# EAGLE design TN Deck _Display Board (EAGLE 9.7.0)
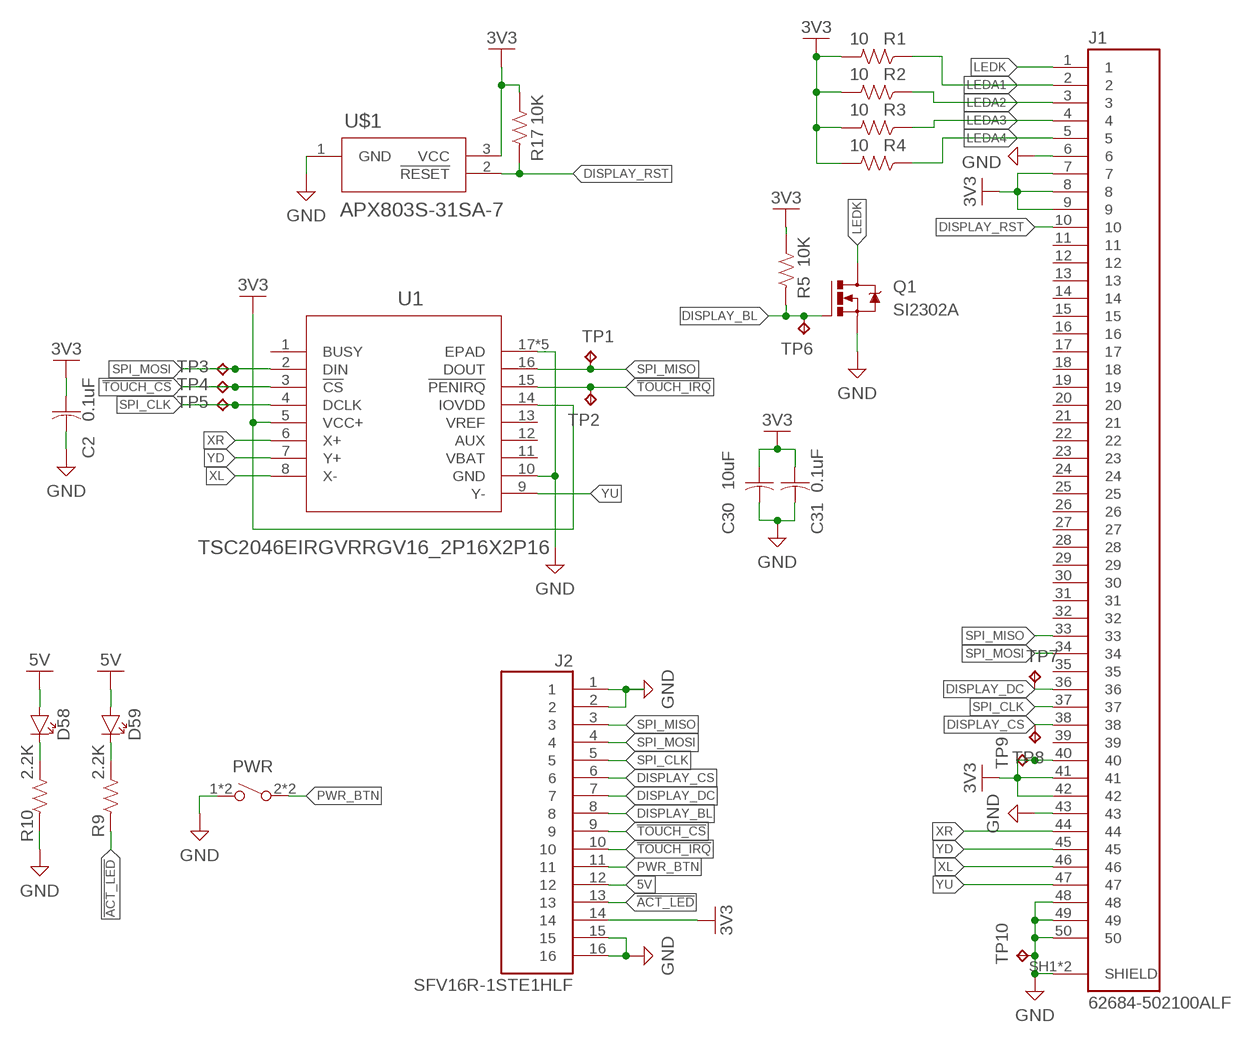
[diagram p0: schematic, sheet 1]

## Parts
C2  0.1uF  C-US_CHIP-0603(1608-METRIC)  [CAPC1608X85]
C30  10uF  C-US_CHIP-0805(2012-METRIC)  [CAPC2012X110]
C31  0.1uF  C-US_CHIP-0603(1608-METRIC)  [CAPC1608X85]
D58  CHIP-FLAT-G_0603-0.80MM  [LEDC1608X80N_FLAT-G]
D59  CHIP-FLAT-G_0603-0.80MM  [LEDC1608X80N_FLAT-G]
J1  62684-502100ALF  [AMPHENOL_62684-502100ALF]
J2  SFV16R-1STE1HLF  [AMPHENOL_SFV16R-1STE1HLF]
PWR  SPST-NO_SWITCH_KMR2  [KMR2]
Q1  SI2302A  NMOSFET_SOT23-GSD  [SOT23]
R1  10  R-US_CHIP-0603(1608-METRIC)  [RESC1608X60]
R2  10  R-US_CHIP-0603(1608-METRIC)  [RESC1608X60]
R3  10  R-US_CHIP-0603(1608-METRIC)  [RESC1608X60]
R4  10  R-US_CHIP-0603(1608-METRIC)  [RESC1608X60]
R5  10K  R-US_CHIP-0603(1608-METRIC)  [RESC1608X60]
R9  2.2K  R-US_CHIP-0603(1608-METRIC)  [RESC1608X60]
R10  2.2K  R-US_CHIP-0603(1608-METRIC)  [RESC1608X60]
R17  10K  R-US_CHIP-0603(1608-METRIC)  [RESC1608X60]
TP1  TPB1,27  [B1,27]
TP2  TPB1,27  [B1,27]
TP3  TPB1,27  [B1,27]
TP4  TPB1,27  [B1,27]
TP5  TPB1,27  [B1,27]
TP6  TPB1,27  [B1,27]
TP7  TPB1,27  [B1,27]
TP8  TPB1,27  [B1,27]
TP9  TPB1,27  [B1,27]
TP10  TPB1,27  [B1,27]
U1  TSC2046EIRGVRRGV16_2P16X2P16  [RGV16_2P16X2P16]
U$1  APX803S-31SA-7  [SOT-23_DIO]

## Nets
3V3: C2.1 C30.1 C31.1 J1.7 J1.8 J1.9 J1.40 J1.41 J1.42 J2.14 R1.2 R2.2 R3.2 R4.2 R5.2 R17.2 TP9.TP U1.5(VCC+) U1.14(IOVDD) U$1.3(VCC)
5V: D58.A D59.A J2.12
!ACT_LED: J2.13 R9.1
!TOUCH_CS: J2.9 TP4.TP U1.3(!CS)
!TOUCH_IRQ: J2.10 TP2.TP U1.15(!PENIRQ)
DISPLAY_BL: J2.8 Q1.1(G) R5.1 TP6.TP
DISPLAY_CS: J1.38 J2.6 TP8.TP
DISPLAY_DC: J1.36 J2.7 TP7.TP
DISPLAY_RST: J1.10 R17.1 U$1.2(!RESET)
GND: C2.2 C30.2 C31.2 J1.6 J1.43 J1.48 J1.49 J1.50 J1.SH1(SHIELD) J1.SH2(SHIELD) J2.1 J2.2 J2.15 J2.16 PWR.1 PWR.4 Q1.2(S) R10.1 TP10.TP U1.10(GND) U1.17(EPAD) U1.V(EPAD) U1.V_1(EPAD) U1.V_2(EPAD) U1.V_3(EPAD) U$1.1(GND)
LEDA1: J1.2 R1.1
LEDA2: J1.3 R2.1
LEDA3: J1.4 R3.1
LEDA4: J1.5 R4.1
LEDK: J1.1 Q1.3(D)
N$3: D59.C R9.2
N$71: D58.C R10.2
PWR_BTN: J2.11 PWR.2 PWR.3
SPI_CLK: J1.37 J2.5 TP5.TP U1.4(DCLK)
SPI_MISO: J1.33 J2.3 TP1.TP U1.16(DOUT)
SPI_MOSI: J1.34 J2.4 TP3.TP U1.2(DIN)
XL: J1.46 U1.8(X-)
XR: J1.44 U1.6(X+)
YD: J1.45 U1.7(Y+)
YU: J1.47 U1.9(Y-)
Unconnected: J1.11 J1.12 J1.13 J1.14 J1.15 J1.16 J1.17 J1.18 J1.19 J1.20 J1.21 J1.22 J1.23 J1.24 J1.25 J1.26 J1.27 J1.28 J1.29 J1.30 J1.31 J1.32 J1.35 J1.39 U1.1(BUSY) U1.11(VBAT) U1.12(AUX)

## Power pins joined to a net without a drawn wire
VREF: U1.13(VREF)

## Library data of the parts
C2 C31 = Capacitor:C-US: Capacitor - ANSI; CATEGORY: Capacitor; PACKAGE_SIZE: 0603; PACKAGE_TYPE: Surface Mount; SUBCATEGORY: Ceramic Capacitors; TYPE: MLCC; VENDOR: Digikey; VPN: 399-C0603C104K3RACTUCT-ND
C30 = Capacitor:C-US: Capacitor - ANSI; CATEGORY: Capacitor; PACKAGE_SIZE: 0805; PACKAGE_TYPE: Surface Mount; SUBCATEGORY: Ceramic Capacitors; TYPE: MLCC; VENDOR: Digikey; VPN: 1292-0805X106K250CT-ND
D58 D59 = LED:CHIP-FLAT-G: Green LED - Generic; CATEGORY: LED; COLOR: Green; DESCRIPTION: Green LED Indication 0603 (1608 Metric); PACKAGE_SIZE: 0603; PACKAGE_TYPE: Surface Mount; SUBCATEGORY: Chip LED; TYPE: Square with Flat Top; VENDOR: Digikey; VPN: 732-4980-1-ND
J1 = 2.8 TFT Display:62684-502100ALF; MANUFACTURER: Amphenol; MAXIMUM_PACKAGE_HEIGHT: 2.00mm; PARTREV: AM; SNAPEDA_PN: 62684-502100ALF; STANDARD: Manufacturer Recommendations; VENDOR: Digikey; VPN: 609-1202-1-ND
J2 = SFV16R-1STE1HLF:SFV16R-1STE1HLF; MANUFACTURER: Amphenol; MAXIMUM_PACKAGE_HEIGHT: 2.36mm; PARTREV: B; STANDARD: Manufacturer Recommendations; VENDOR: Digikey; VPN: 609-4313-1-ND
PWR = Switch:SPST-NO_SWITCH: SPST Switches with NO Configuration; CATEGORY: Switches; DATASHEET: https://www.ckswitches.com/media/1479/kmr2.pdf; DESCRIPTION: Tactile Switch SPST-NO Top Actuated Surface Mount; MANUFACTURER: C&K; MPN: KMR211G LFS; OPERATING_TEMPERATURE: -40°C ~ 85°C; PACKAGE_SIZE: NA; PACKAGE_TYPE: Surface Mount; PART_STATUS: Active; ROHS: Compliant; SERIES: KMR2; SUBCATEGORY: Tactile Switches; TYPE: SPST-NO; VENDOR: Digikey; VPN: 401-1426-1-ND
Q1 = Transistor:NMOSFET: N-Channel MOSFET - Generic; CATEGORY: Transistor; DATASHEET: https://www.analog.com/media/en/package-pcb-resources/package/pkg_pdf/ltc-legacy-sot-23/sot3%2005-08-1631%20rev%20d.pdf; DESCRIPTION: Generic N Channel MOSFET SOT23-GSD Package Surface Mount; PACKAGE_SIZE: SOT23; PACKAGE_TYPE: Surface Mount; SUBCATEGORY: MOSFET; TYPE: N-Channel; VENDOR: Digikey; VPN: 4518-SI2302ACT-ND
R1-R4 = Resistor:R-US: Resistor Fixed - ANSI; CATEGORY: Resistors; DESCRIPTION: Chip Resistor 1.60 X 0.82 X 0.60 mm body 0603(1608-METRIC) Package; PACKAGE_SIZE: 0603; PACKAGE_TYPE: Surface Mount; VENDOR: Digikey; VPN: 541-10.0HCT-ND
R5 R17 = Resistor:R-US: Resistor Fixed - ANSI; CATEGORY: Resistors; DESCRIPTION: Chip Resistor 1.60 X 0.82 X 0.60 mm body 0603(1608-METRIC) Package; PACKAGE_SIZE: 0603; PACKAGE_TYPE: Surface Mount; VENDOR: Digikey; VPN: 541-10.0KHCT-ND
R9 R10 = Resistor:R-US: Resistor Fixed - ANSI; CATEGORY: Resistors; DESCRIPTION: Chip Resistor 1.60 X 0.82 X 0.60 mm body 0603(1608-METRIC) Package; PACKAGE_SIZE: 0603; PACKAGE_TYPE: Surface Mount; VENDOR: Digikey; VPN: 541-2.20KHCT-ND
TP1-TP10 = testpad:TP: Test pad
U1 = TSC2046EIRGVR:TSC2046EIRGVR; COPYRIGHT: Copyright (C) 2026 Ultra Librarian. All rights reserved.; DATASHEET: https://www.ti.com/lit/gpn/tsc2046e; DESCRIPTION: 4-Wire Touch Screen Controller with low voltage digital I/O and extended ESD protection 16-VQFN -40 to 85; MANUFACTURER_NAME: Texas Instruments; MANUFACTURER_PART_NUMBER: TSC2046EIRGVR; VENDOR: Digikey; VPN: 296-46257-1-ND
U$1 = APX803S-31SA-7:APX803S-31SA-7; VENDOR: Digikey; VPN: APX803S-31SA-7DICT-ND

## Board
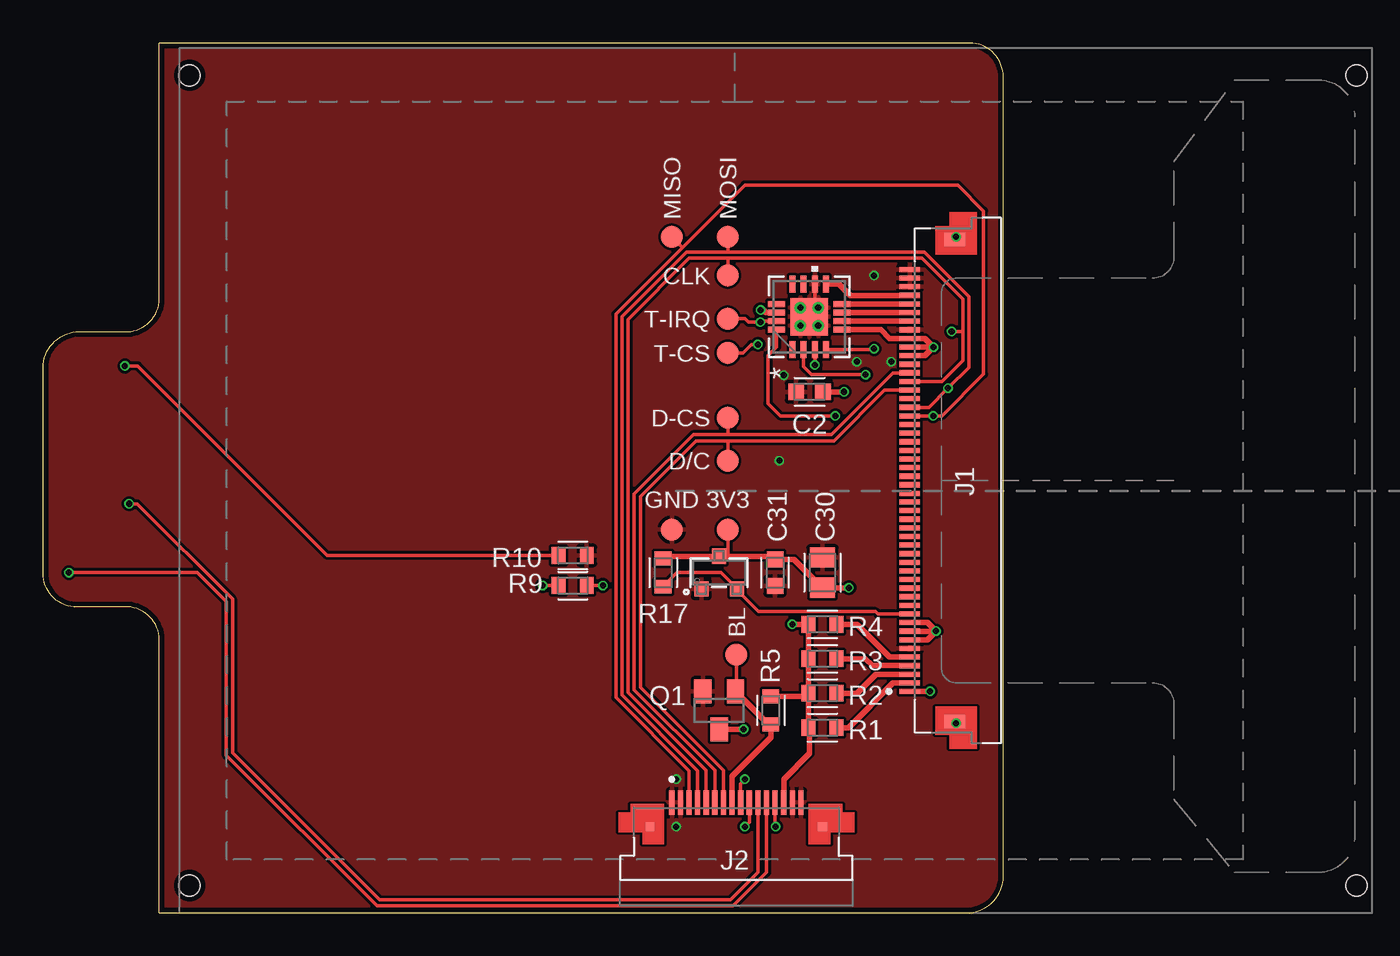
[diagram p1: board, top side]
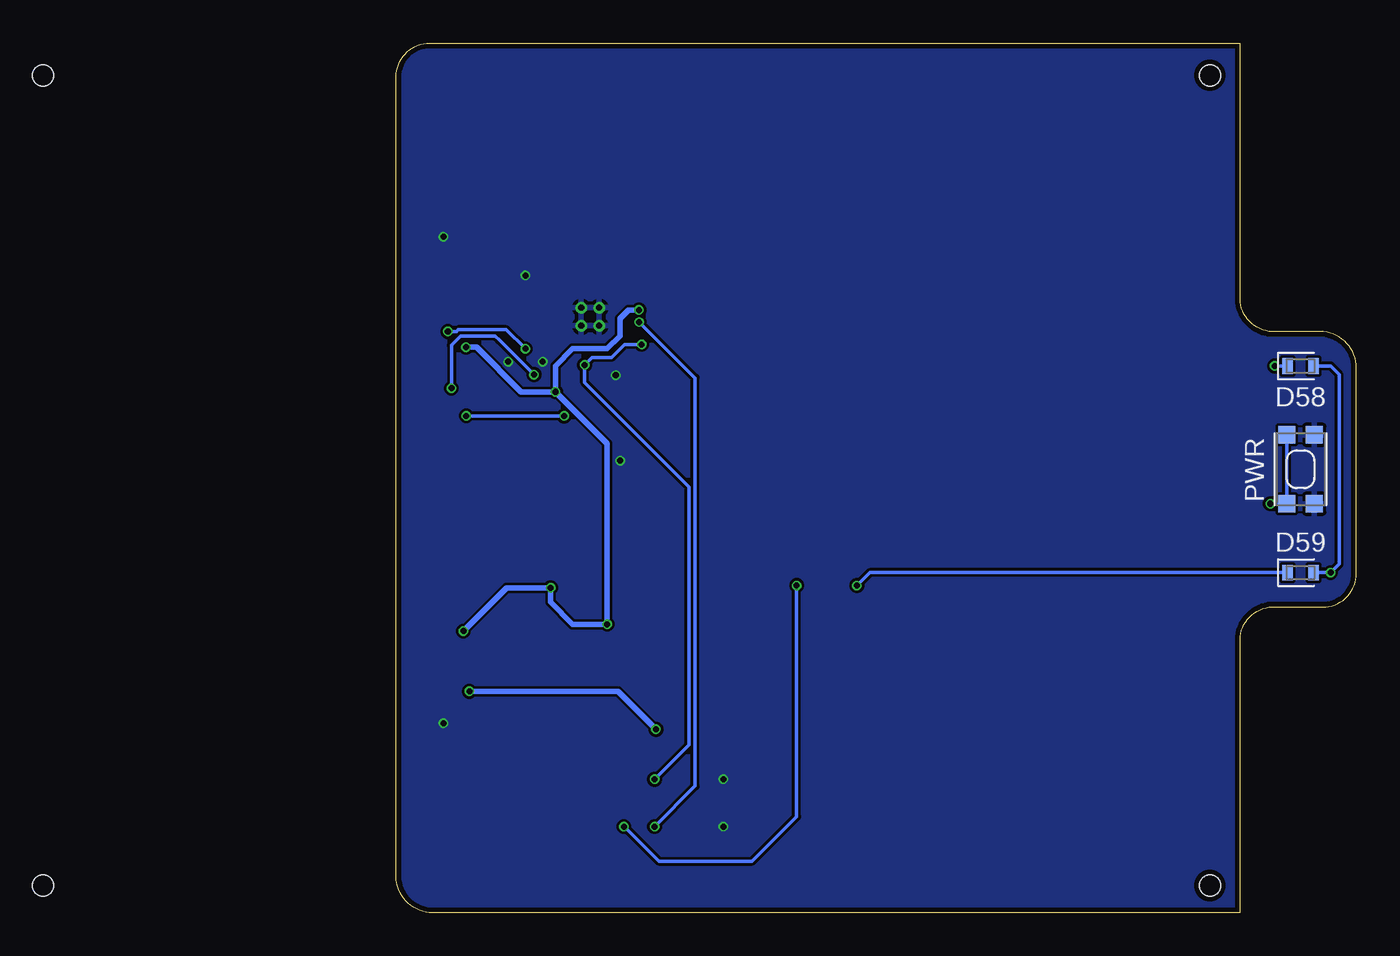
[diagram p2: board, bottom side, seen from below]

Size 55.75 x 50.5 mm. Coordinates in mm from the lower left corner, seen from the top.
Outline: 6.75,0 53.63,0 arc90 55.75,2.12 55.75,48.54 arc90 53.79,50.5 6.75,50.5 6.75,35.46 arc-90 4.54,33.75 2.12,33.75 arc90 0,31.63 0,19.71 arc90 1.96,17.75 4.54,17.75 arc-90 6.75,16.04 6.75,0
Copper layers (1*16): Top 0.035mm / dielectric 1.5mm / Bottom 0.035mm
Design rules "PCBWay_2L_152um-Track.dru *": minimum track width 6mil, minimum drill 0.3mm, track to track 6mil, track to pad 6mil, pad to pad 6mil, via to via 6mil, smd to smd 0mil, copper to edge 0.3mm, drill to drill 10mil, minimum pad ring 6mil, minimum via ring 0.1mm, stop-mask expansion 2mil, vias tented up to drill 0.45mm, thermal gap 0.2mm

### Footprints (pad centres in the part's own frame; a part is rotated, then mirrored left to right if it is on the bottom)
CAPC1608X85 = smd 0.921 x 0.97: 1 -0.775,0; 2 0.775,0
CAPC2012X110 = smd 1.165 x 1.465: 1 -0.875,0; 2 0.875,0
LEDC1608X80N_FLAT-G = smd 0.612 x 0.912: A 0.75,0; C -0.75,0
AMPHENOL_62684-502100ALF = smd 0.3 x 1.2: 1 -12.25,5.34; 2 -11.75,5.34; 3 -11.25,5.34; 4 -10.75,5.34; 5 -10.25,5.34; 6 -9.75,5.34; 7 -9.25,5.34; 8 -8.75,5.34; 9 -8.25,5.34; 10 -7.75,5.34; 11 -7.25,5.34; 12 -6.75,5.34; 13 -6.25,5.34; 14 -5.75,5.34; 15 -5.25,5.34; 16 -4.75,5.34; 17 -4.25,5.34; 18 -3.75,5.34; 19 -3.25,5.34; 20 -2.75,5.34; 21 -2.25,5.34; 22 -1.75,5.34; 23 -1.25,5.34; 24 -0.75,5.34; 25 -0.25,5.34; 26 0.25,5.34; 27 0.75,5.34; 28 1.25,5.34; 29 1.75,5.34; 30 2.25,5.34; 31 2.75,5.34; 32 3.25,5.34; 33 3.75,5.34; 34 4.25,5.34; 35 4.75,5.34; 36 5.25,5.34; 37 5.75,5.34; 38 6.25,5.34; 39 6.75,5.34; 40 7.25,5.34; 41 7.75,5.34; 42 8.25,5.34; 43 8.75,5.34; 44 9.25,5.34; 45 9.75,5.34; 46 10.25,5.34; 47 10.75,5.34; 48 11.25,5.34; 49 11.75,5.34; 50 12.25,5.34 | smd 0.8 x 1.2: SH1 -14,2.74; SH2 14,2.74 | hole 1.2: 23.52,47.16; -23.52,47.16; 23.52,-20.59; -23.52,-20.59
AMPHENOL_SFV16R-1STE1HLF = smd 0.3 x 1.4: 1 -3.75,2.4; 2 -3.25,2.4; 3 -2.75,2.4; 4 -2.25,2.4; 5 -1.75,2.4; 6 -1.25,2.4; 7 -0.75,2.4; 8 -0.25,2.4; 9 0.25,2.4; 10 0.75,2.4; 11 1.25,2.4; 12 1.75,2.4; 13 2.25,2.4; 14 2.75,2.4; 15 3.25,2.4; 16 3.75,2.4 | smd 0.5 x 0.5: SH1 -5,1; SH2 5,1
KMR2 = smd 1 x 1: 1 2,0.8; 2 2,-0.8; 3 -2,-0.8; 4 -2,0.8
SOT23 = smd 1 x 1.4: 1 -0.95,-1.1; 2 0.95,-1.1; 3 0,1.1
RESC1608X60 = smd 0.799 x 0.974: 1 -0.815,0; 2 0.815,0
B1,27 = smd 1.27 x 1.27: TP 0,0
RGV16_2P16X2P16 = smd 1 x 0.35: 1 -1.9,0.975; 2 -1.9,0.325; 3 -1.9,-0.325; 4 -1.9,-0.975; 9 1.9,-0.975; 10 1.9,-0.325; 11 1.9,0.325; 12 1.9,0.975 | smd 0.35 x 1: 5 -0.75,-1.9; 6 -0.25,-1.9; 7 0.25,-1.9; 8 0.75,-1.9; 13 0.75,1.9; 14 0.25,1.9; 15 -0.25,1.9; 16 -0.75,1.9 | smd 2.16 x 2.16: 17 0,0 | drill 0.35: V -0.521,-0.521; V_1 -0.521,0.521; V_2 0.521,-0.521; V_3 0.521,0.521
SOT-23_DIO = smd 0.813 x 0.889: 1 -1.025,-0.945; 2 1.025,-0.945; 3 0,0.945

### Placement (x,y rotation side)
C2  44.5,30.25 180 top
C30  45.25,19.75 90 top
C31  42.5,19.75 270 top
D58  3.25,31.75 0 bottom
D59  3.25,19.75 0 bottom
J1  55.66,25.1 90 top
J2  40.25,4 0 top
PWR  3.25,25.75 270 bottom
Q1  39.25,11.75 180 top
R1  45.25,10.75 180 top
R2  45.25,12.75 180 top
R3  45.25,14.75 180 top
R4  45.25,16.75 180 top
R5  42.25,11.75 90 top
R9  30.75,19 180 top
R10  30.75,20.75 180 top
R17  36,19.75 90 top
TP1  36.5,39.25 0 top
TP2  39.75,34.5 0 top
TP3  39.75,39.25 0 top
TP4  39.75,32.5 0 top
TP5  39.75,37 0 top
TP6  40.25,15 0 top
TP7  39.75,26.25 0 top
TP8  39.75,28.75 0 top
TP9  39.75,22.25 0 top
TP10  36.5,22.25 0 top
U1  44.48,34.61 90 top
U$1  39.25,19.75 0 top

### Tracks (layer width: path | path; a pad name or v marks a point on that pad's centre or on a via)
3V3  (via drill 0.35)
  Top 0.203: TP9.TP 39.75,20.7
  Top 0.305: U1.5 48.65,33.85 49.15,33.35 J1.42 51.19,33.35 v51.7,32.84 | J1.40 51.2,32.35 v51.7,32.84 | J1.41 v51.69,32.85 v51.7,32.84 | J2.14 43,7.75 44.5,9.25 44.5,10.69 R1.2 R2.2 | R2.2 R3.2 R4.2 v43.5,16.75 | R17.2 36.13,20.7 U$1.3 39.75,20.7 42.33,20.7 C31.1 43.6,20.52 C30.1 v46.78,18.88 v46.78,18.87 | J1.9 51.35,16.85 v51.85,16.35 v51.84,16.35 | J1.8 v51.84,16.35 | J1.7 51.34,15.85 v51.84,16.35 | v46.5,30.25 C2.1 | v41.65,35 41.82,35 41.96,34.86 U1.14 | R5.2 44.25,12.56 R2.2
  Bottom 0.305: v51.85,16.35 49.33,18.87 v46.78,18.87 46.78,18.03 45.5,16.75 v43.5,16.75 43.5,27.25 v46.5,30.25 | v51.7,32.84 51.09,32.84 48.5,30.25 v46.5,30.25 | v46.5,30.25 46.5,31.75 45.5,32.75 43.5,32.75 42.75,33.5 42.75,34.5 42.25,35 v41.65,35
5V  (via drill 0.35)
  Top 0.203: J2.12 42,2.34 40.07,0.4 19.39,0.4 10.64,9.15 10.64,18.06 8.96,19.75 v1.5,19.75
  Bottom 0.203: D59.A v1.5,19.75 1,20.25 1,31.25 1.5,31.75 D58.A
!ACT_LED  (via drill 0.35)
  Top 0.203: v32.5,19 32.38,19 R9.1 | J2.13 42.5,5.03 v42.53,5
  Bottom 0.203: v32.5,19 32.5,5.58 35.08,3 40.5,3 42.5,5 v42.53,5
!TOUCH_CS  (via drill 0.35)
  Top 0.203: J2.9 40.5,7.5 v40.75,7.75 | v44.81,31.8 v44.81,31.81 U1.3 | v41.5,33 41.12,33 40.62,32.5 TP4.TP
  Bottom 0.203: v40.75,7.75 38.75,9.75 38.75,24 38.75,24.73 44.81,30.79 v44.81,31.8 44.37,32.25 43.25,32.25 42.5,33 v41.5,33
!TOUCH_IRQ  (via drill 0.35)
  Top 0.203: v40.75,5 41,5.25 J2.10 | U1.15 41.7,34.35 v41.64,34.3 40.95,34.3 40.75,34.5 TP2.TP
  Bottom 0.203: v41.64,34.3 38.39,31.05 38.39,7.36 v40.75,5
DISPLAY_BL
  Top 0.203: TP6.TP 40.25,12.9 Q1.1
  Top 0.305: Q1.1 42.12,10.94 R5.1 42.25,10.19 40,7.93 J2.8
DISPLAY_CS
  Top 0.203: J2.6 39,8.26 34.32,12.94 34.32,24.32 37.76,27.76 39.75,27.76 | J1.38 49.35,31.35 45.76,27.76 39.75,27.76 | TP8.TP 39.75,27.76
DISPLAY_DC
  Top 0.203: J2.7 39.5,8.26 34.67,13.09 34.67,24.17 37.91,27.41 39.75,27.41 | J1.36 48.85,30.35 45.91,27.41 39.75,27.41 | TP7.TP 39.75,27.41
DISPLAY_RST
  Top 0.203: R17.1 36.81,19.75 39.37,19.75 40.27,18.84 40.27,18.73 U$1.2 40.27,18.75 41.53,17.49 48.32,17.49 48.46,17.35 J1.10
GND  (via drill 0.35)
  Top 0.203: U1.10 44.81,35.32 44.94,35.19 | 44.94,35.19 U1.V_2 | U1.17 44.48,34.73 44.94,35.19 | U1.17 U1.V | U1.17 U1.V_1 | U1.17 U1.V_3
  other vias: 53,39.25 53,11 36.75,7.75 36.75,5 47.25,32 49.25,32 43,31.22 48.25,37 42.75,26.25
  pour Top: -3.42,-1.42 58.92,-1.42 58.92,52.17 -3.42,52.17
  pour Bottom: -5.6,-3.6 61.1,-3.6 61.1,54.1 -5.6,54.1
LEDA1
  Top 0.305: J1.2 49.35,13.35 46.75,10.75 R1.1
LEDA2
  Top 0.305: J1.3 48.35,13.85 47.25,12.75 R2.1
LEDA3
  Top 0.305: J1.4 48.15,14.35 47.75,14.75 R3.1
LEDA4
  Top 0.305: J1.5 49.15,14.85 47.25,16.75 R4.1
LEDK  (via drill 0.35)
  Top 0.305: Q1.3 v40.66,10.65 v40.67,10.65 | v51.5,12.86 v51.49,12.85 J1.1
  Bottom 0.305: v40.67,10.65 42.87,12.86 v51.5,12.86
N$3  (via drill 0.35)
  Top 0.203: v29,19 R9.2
  Bottom 0.203: D59.C 28.25,19.75 v29,19
N$71  (via drill 0.35)
  Top 0.203: R10.2 16.5,20.75 5.5,31.75 v4.75,31.75
  Bottom 0.203: D58.C v4.75,31.75
PWR_BTN  (via drill 0.35)
  Top 0.203: v5,23.75 5.46,23.75 11,18.21 11,9.29 19.54,0.76 39.92,0.76 41.5,2.34 J2.11
  Bottom 0.203: v5,23.75 PWR.2 PWR.3
SPI_CLK  (via drill 0.35)
  Top 0.203: J1.37 52.18,30.85 53.39,32.06 53.39,33.75 | J2.5 38.5,8.26 33.96,12.79 33.96,34.45 37.51,38 39.75,38 | 53.39,33.75 53.39,35.63 51.02,38 39.75,38 | U1.4 47,32.7 48.2,32.7 v48.25,32.75 | v52.75,33.75 53.39,33.75 | TP5.TP 39.75,38
  Bottom 0.203: v52.75,33.75 52.25,33.75 52.15,33.86 49.36,33.86 v48.25,32.75
SPI_MISO  (via drill 0.35)
  Top 0.203: J2.3 37.5,8.25 33.25,12.5 33.25,34.75 37.12,38.62 | J1.33 v51.68,28.85 52.18,28.85 54.61,31.28 54.61,40.75 53.11,42.25 40.75,42.25 37.22,38.72 37.12,38.62 | v46,28.85 42.8,28.85 42.08,29.57 42.08,32.35 42.58,32.85 U1.16 | TP1.TP 37.12,38.62
  Bottom 0.203: v46,28.85 v51.68,28.85
SPI_MOSI  (via drill 0.35)
  Top 0.203: J1.34 51.43,29.35 v52.54,30.46 53.75,31.67 53.75,35.78 51.17,38.36 39.75,38.36 | J2.4 38,8.25 33.61,12.65 33.61,34.6 37.36,38.36 39.75,38.36 | U1.2 44.16,31.71 44.62,31.25 v47.75,31.25 | TP3.TP 39.75,38.36
  Bottom 0.203: v47.75,31.25 49.75,33.25 50,33.5 52,33.5 52.54,32.96 v52.54,30.46
XL
  Top 0.305: U1.8 J1.46
XR
  Top 0.305: U1.6 J1.44
YD
  Top 0.305: U1.7 J1.45
YU
  Top 0.305: J1.47 46.86,35.85 46.21,36.51 U1.9

### Text on the board
tNames: MISO | MOSI | CLK | T-IRQ | T-CS | D-CS | D/C | GND | 3V3 | BL